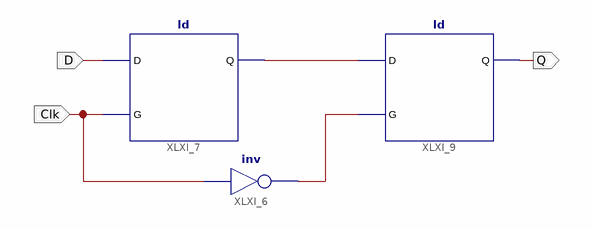
[diagram p0: schematic sheet 1]
// Xilinx ISE schematic ffms.sch (spartan3e) as structural Verilog: 3 symbols, 3 ports
module ffms (
  input  Clk,
  input  D,
  output Q
);

  wire XLXN_7, XLXN_8;

  not XLXI_6 (XLXN_7, Clk);
  ld XLXI_7 (.D(D), .G(Clk), .Q(XLXN_8));
  ld XLXI_9 (.D(XLXN_8), .G(XLXN_7), .Q(Q));
endmodule
